# EAGLE design SDRX_40M1 (EAGLE 7.3.0)
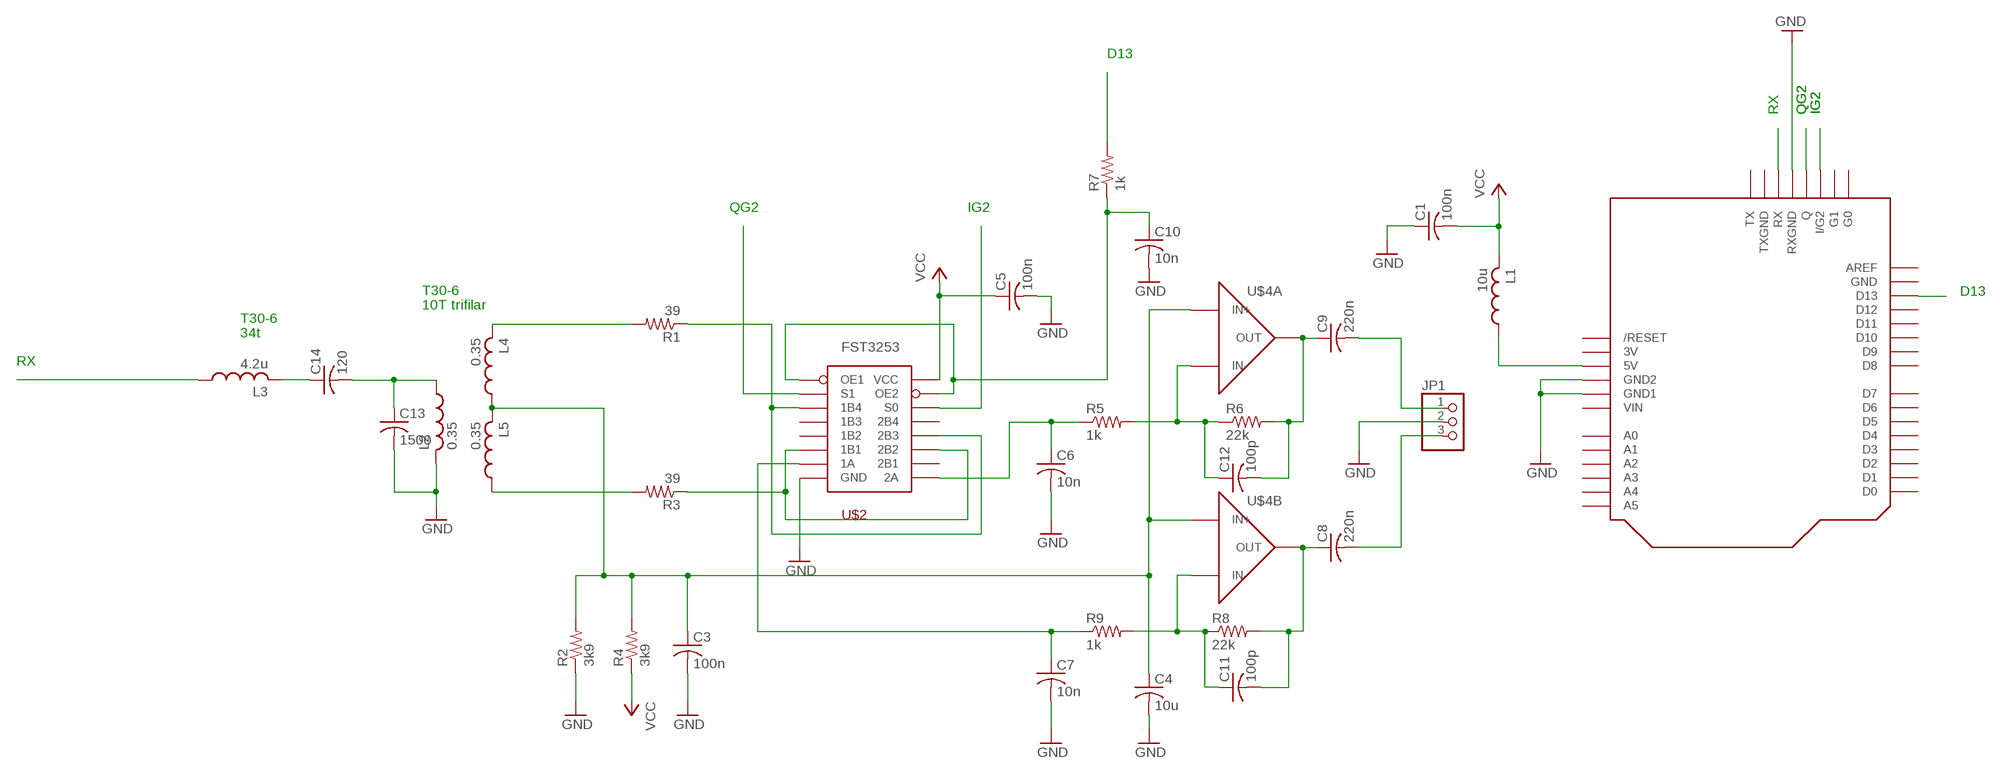
[diagram p0: schematic, sheet 1]

## Parts
C1  100n  C-US050-030X075  [C050-030X075]
C3  100n  C-US050-030X075  [C050-030X075]
C4  10u  C-US050-030X075  [C050-030X075]
C5  100n  C-US050-030X075  [C050-030X075]
C6  10n  C-US050-030X075  [C050-030X075]
C7  10n  C-US050-030X075  [C050-030X075]
C8  220n  C-US050-030X075  [C050-030X075]
C9  220n  C-US050-030X075  [C050-030X075]
C10  10n  C-US050-030X075  [C050-030X075]
C11  100p  C-US050-030X075  [C050-030X075]
C12  100p  C-US050-030X075  [C050-030X075]
C13  1500  C-US050-025X075  [C050-025X075]
C14  120  C-US050-025X075  [C050-025X075]
JP1  PINHD-1X3  [1X03]
L1  10u  L-US0207/10  [0207/10]
L2  0.35  L-US0207/10  [0207/10]
L3  4.2u  L-US0207/10  [0207/10]
L4  0.35  L-US0207/10  [0207/10]
L5  0.35  L-US0207/10  [0207/10]
R1  39  R-US_0207/10  [0207/10]
R2  3k9  R-US_0207/10  [0207/10]
R3  39  R-US_0207/10  [0207/10]
R4  3k9  R-US_0207/10  [0207/10]
R5  1k  R-US_0207/10  [0207/10]
R6  22k  R-US_0207/10  [0207/10]
R7  1k  R-US_0207/10  [0207/10]
R8  22k  R-US_0207/10  [0207/10]
R9  1k  R-US_0207/10  [0207/10]
U$1  RF-SHIELD  [SHIELD-RF]
U$2  FST3253  [FST3253]
U$4  TLV2462  [TLV2462]

## Nets
D13: R7.2 U$1.D13
GND: C1.1 C3.2 C4.2 C5.2 C6.2 C7.2 C10.2 C13.2 JP1.2 L2.2 R2.1 U$1.GND1 U$1.GND2 U$1.RXGND U$2.GND
IG2: U$1.I/G2 U$2.S0
N$1: C3.1 C4.1 L4.1 L5.2 R2.2 R4.2 U$4.3(A:IN+) U$4.5(B:IN+)
N$2: C13.1 C14.2 L2.1
N$3: L4.2 R1.2
N$4: L1.1 U$1.5V
N$5: R3.1 U$2.1B1 U$2.2B2
N$6: L5.1 R3.2
N$7: R1.1 U$2.1B4 U$2.2B3
N$10: C14.1 L3.2
N$12: C10.1 R7.1 U$2.OE1 U$2.OE2
N$14: C9.1 C12.2 R6.2 U$4.1(A:OUT)
N$15: C9.2 JP1.1
N$16: C8.1 C11.2 R8.2 U$4.7(B:OUT)
N$17: C8.2 JP1.3
N$19: C11.1 R8.1 R9.2 U$4.6(B:IN-)
N$21: C12.1 R5.2 R6.1 U$4.2(A:IN-)
N$23: C7.1 R9.1 U$2.1A
N$24: C6.1 R5.1 U$2.2A
QG2: U$1.Q U$2.S1
RX: L3.1 U$1.RX
VCC: C1.2 C5.1 L1.2 R4.1 U$2.VCC
Unconnected: U$1.A0 U$1.A1 U$1.A2 U$1.A3 U$1.A4 U$1.A5 U$1.AREF U$1.D0 U$1.D1 U$1.D2 U$1.D3 U$1.D4 U$1.D5 U$1.D6 U$1.D7 U$1.D8 U$1.D9 U$1.D10 U$1.D11 U$1.D12 U$1.G0 U$1.G1 U$1.RESET(/RESET) U$1.TX U$2.1B2 U$2.1B3 U$2.2B1 U$2.2B4

## Notes on the sheet
- D13
- RX | QG2 | QG2 | IG2 | IG2
- QG2 | IG2
- D13
- T30-6
  10T trifilar
- T30-6
  34t
- RX

## Power pins joined to a net without a drawn wire
3V: U$1.3V
GND: U$1.GND U$4.4(PWR:GND)
TXGND: U$1.TXGND
VCC: U$4.8(PWR:VCC)
VIN: U$1.VIN

## Library data of the parts
C1 C3-C14 = rcl:C-US: CAPACITOR, American symbol
JP1 = pinhead:PINHD-1X3: PIN HEADER
L1-L5 = rcl:L-US: INDUCTOR, American symbol
R1-R9 = rcl:R-US_: RESISTOR, American symbol
U$1 = Arduino-M6KWH:RF-SHIELD: Arduino shield M6KWH RFBUS
U$2 = m6kwh:FST3253: Dual 4 way CMOS Sw
U$4 = m6kwh:TLV2462: Dual Op Amp

## Board
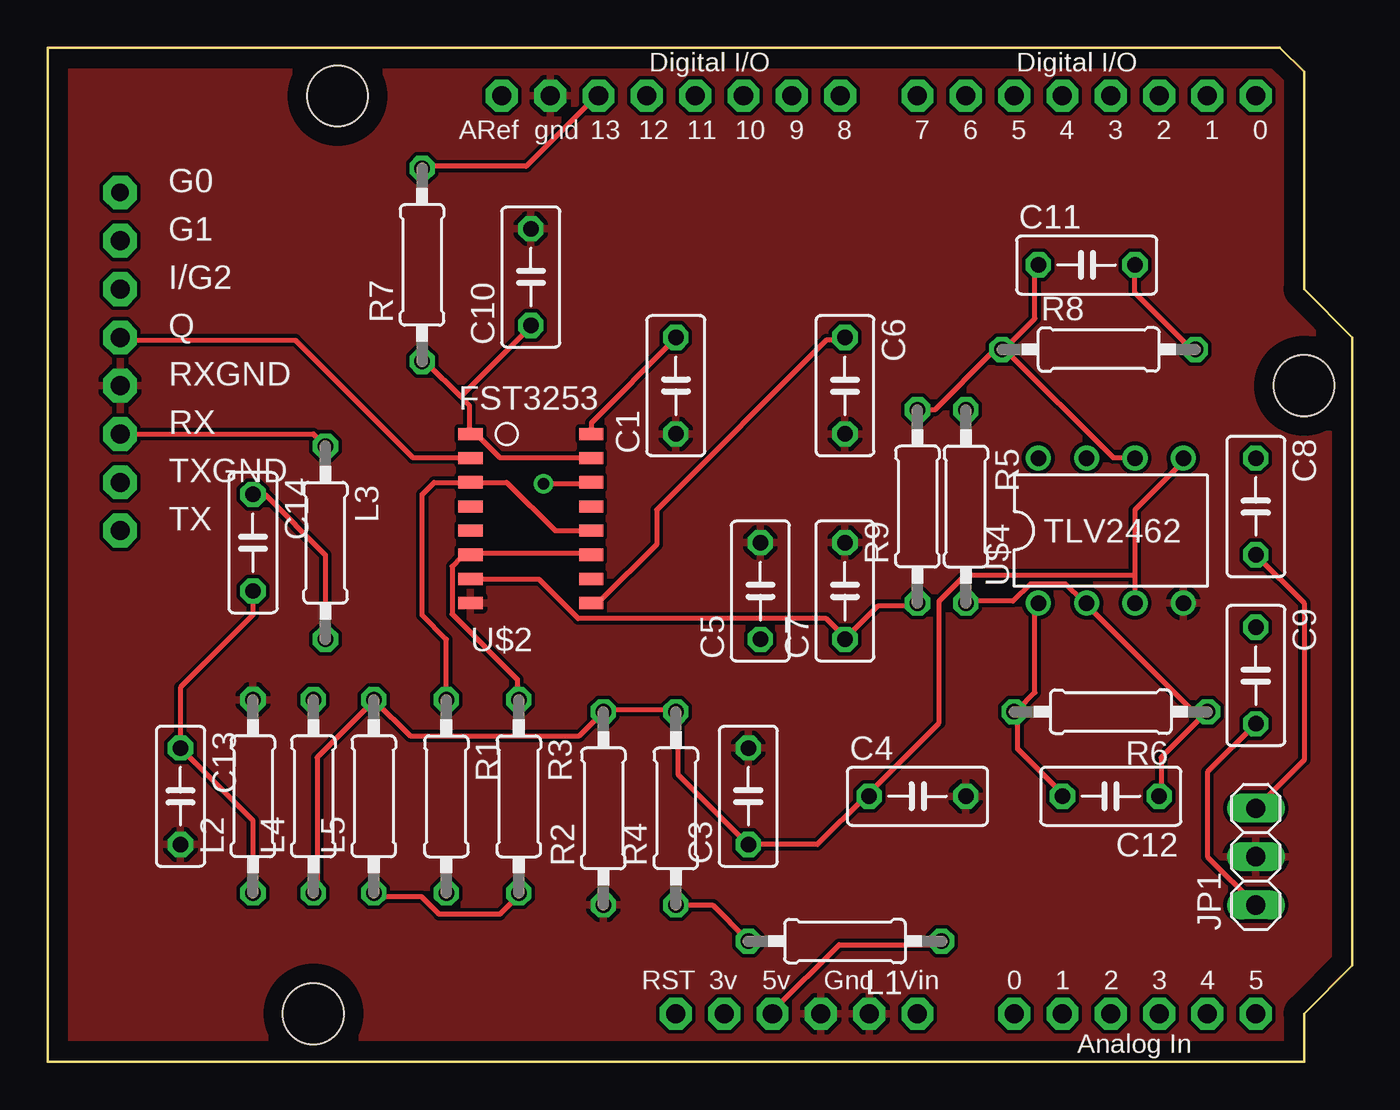
[diagram p1: board, top side]
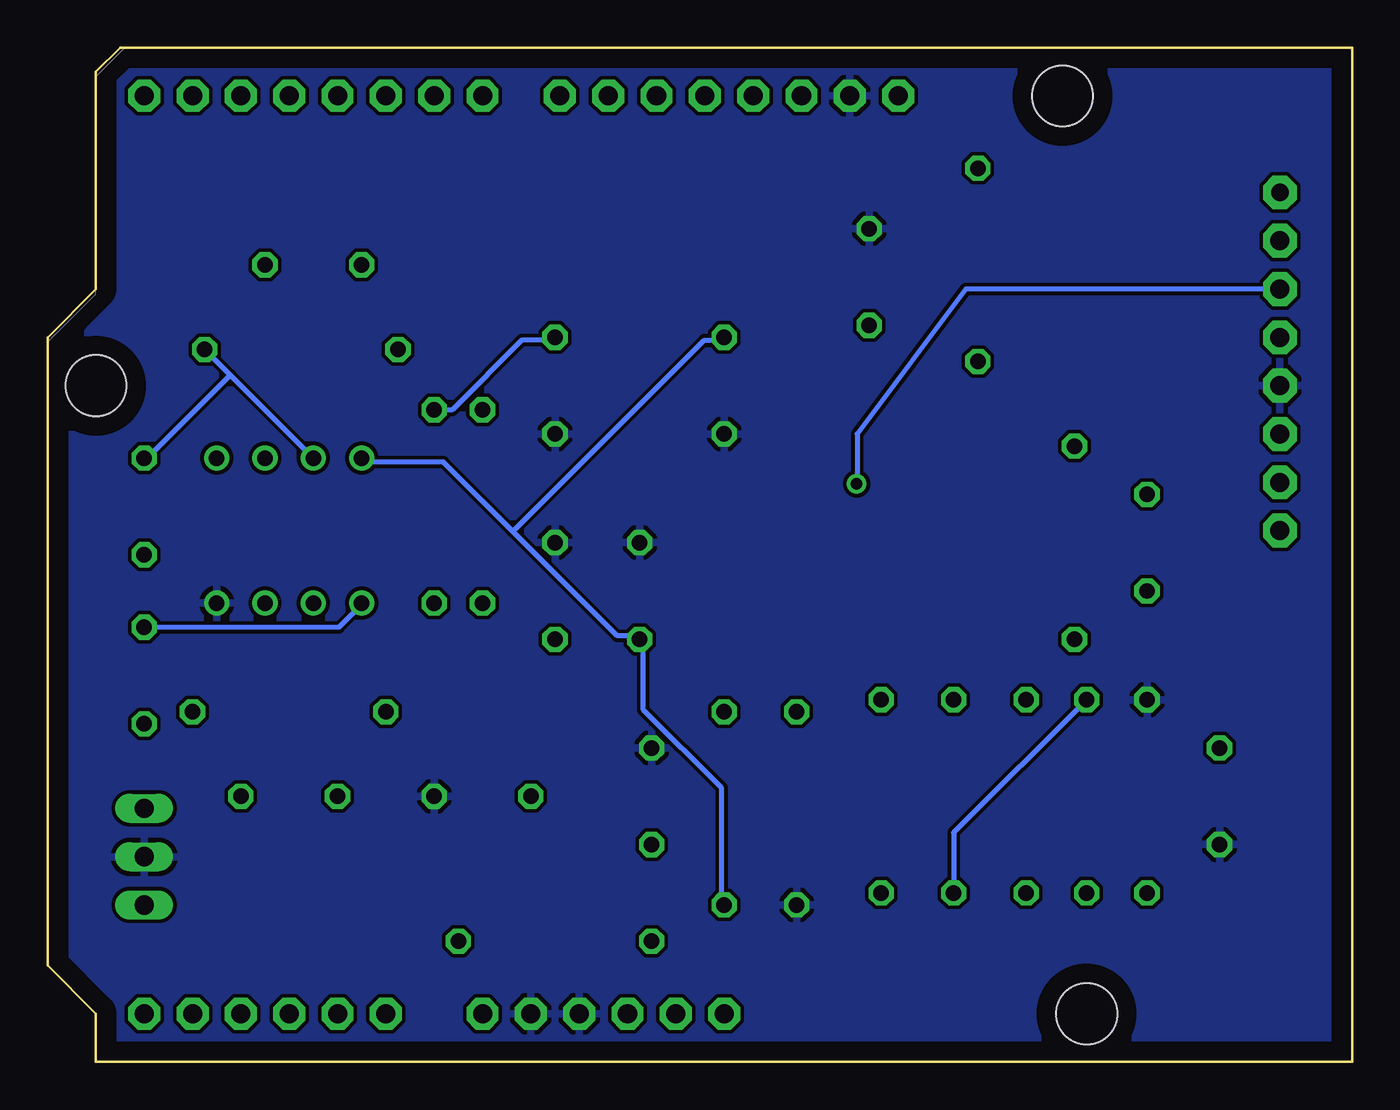
[diagram p2: board, bottom side, seen from below]

Size 68.58 x 53.34 mm. Coordinates in mm from the lower left corner, seen from the top.
Copper layers (1*16): Top 0.035mm / dielectric 1.5mm / Bottom 0.035mm
Design rules "default": minimum track width 10mil, minimum drill 24mil, track to track 8mil, track to pad 8mil, pad to pad 8mil, via to via 8mil, smd to smd 8mil, copper to edge 40mil, drill to drill 8mil, minimum pad ring 10mil, minimum via ring 8mil, stop-mask expansion 4mil, vias tented up to drill 0mil, thermal gap 10mil

### Footprints (pad centres in the part's own frame; a part is rotated, then mirrored left to right if it is on the bottom)
C050-030X075 = drill 0.813 octagon: 1 -2.54,0; 2 2.54,0
C050-025X075 = drill 0.813 octagon: 1 -2.54,0; 2 2.54,0
1X03 = drill 1.016 long: 1 -2.54,0; 2 0,0; 3 2.54,0
0207/10 = drill 0.813 octagon: 1 -5.08,0; 2 5.08,0
SHIELD-RF = drill 1 pad 1.676 octagon: 3V 35.56,2.54; 5V 38.1,2.54; A0 50.8,2.54; A1 53.34,2.54; A2 55.88,2.54; A3 58.42,2.54; A4 60.96,2.54; A5 63.5,2.54; AREF 23.876,50.8; D0 63.5,50.8; D1 60.96,50.8; D2 58.42,50.8; D3 55.88,50.8; D4 53.34,50.8; D5 50.8,50.8; D6 48.26,50.8; D7 45.72,50.8; D8 41.656,50.8; D9 39.116,50.8; D10 36.576,50.8; D11 34.036,50.8; D12 31.496,50.8; D13 28.956,50.8; GND 26.416,50.8; GND1 43.18,2.54; GND2 40.64,2.54; RESET 33.02,2.54; VIN 45.72,2.54 | drill 0.9 pad 1.778 octagon: G0 3.81,45.72 | drill 1 pad 1.778 octagon: G1 3.81,43.18; I/G2 3.81,40.64; Q 3.81,38.1; RX 3.81,33.02; RXGND 3.81,35.56; TX 3.81,27.94; TXGND 3.81,30.48 | hole 3.2: 15.24,50.8; 66.04,35.56; 13.97,2.54
FST3253 = smd 1.27 x 0.635: 1A -3.175,-3.81; 1B1 -3.175,-2.54; 1B2 -3.175,-1.27; 1B3 -3.175,0; 1B4 -3.175,1.27; 2A 3.175,-5.08; 2B1 3.175,-3.81; 2B2 3.175,-2.54; 2B3 3.175,-1.27; 2B4 3.175,0; GND -3.175,-5.08; OE1 -3.175,3.81; OE2 3.175,2.54; S0 3.175,1.27; S1 -3.175,2.54; VCC 3.175,3.81
TLV2462 = drill 0.813 pad 1.27: 1 -3.81,-3.81; 2 -1.27,-3.81; 3 1.27,-3.81; 4 3.81,-3.81; 5 3.81,3.81; 6 1.27,3.81; 7 -1.27,3.81; 8 -3.81,3.81

### Placement (x,y rotation side)
C1  33.02,35.56 90 top
C3  36.83,13.97 90 top
C4  45.72,13.97 0 top
C5  37.47,24.77 90 top
C6  41.91,35.56 270 top
C7  41.91,24.77 90 top
C8  63.5,29.21 270 top
C9  63.5,20.32 270 top
C10  25.4,41.27 90 top
C11  54.61,41.91 0 top
C12  55.88,13.97 180 top
C13  6.99,13.97 270 top
C14  10.79,27.3 270 top
JP1  63.5,10.79 90 top
L1  41.91,6.35 180 top
L2  10.79,13.97 90 top
L3  14.61,27.3 270 top
L4  13.97,13.97 90 top
L5  17.14,13.97 90 top
R1  20.95,13.97 270 top
R2  29.21,13.34 90 top
R3  24.77,13.97 270 top
R4  33.02,13.34 90 top
R5  48.26,29.21 270 top
R6  55.88,18.41 180 top
R7  19.68,41.91 90 top
R8  55.24,37.47 0 top
R9  45.72,29.21 90 top
U$1  0,0 0 top
U$2  25.4,29.21 0 top
U$4  55.88,27.94 0 top

### Tracks (layer width: path | path; a pad name or v marks a point on that pad's centre or on a via)
D13
  Top 0.254: R7.2 19.89,47.09 25.15,47.09 28.8,50.75 U$1.D13
GND
  pour Bottom: 0,53.34 64.77,53.34 66.04,52.07 66.04,40.64 68.58,38.1 68.58,5.08 66.04,2.54 66.04,0 0,0
  pour Top: 0,53.34 64.77,53.34 66.04,52.07 66.04,40.64 68.58,38.1 68.58,5.08 66.04,2.54 66.04,0 0,0
IG2  (via drill 0.61)
  Top 0.254: v26.06,30.4 28.57,30.4 U$2.S0
  Bottom 0.254: U$1.I/G2 20.32,40.64 26.04,33.02 26.04,30.48 v26.06,30.4
N$1
  Top 0.254: L4.1 14.17,8.91 14.17,16 17.14,18.97 L5.2 19.05,17.14 27.94,17.14 R2.2 29.26,18.52 32.92,18.52 R4.2 33.15,18.29 33.15,15.09 36.8,11.43 C3.1 40.46,11.43 42.98,13.95 C4.1 43.2,14.17 46.86,17.83 46.86,24.23 48.23,25.6 57.15,25.6 | 57.15,25.6 57.15,29.03 59.66,31.55 U$4.5 | 57.15,25.6 U$4.3
N$2
  Top 0.254: L2.1 10.79,12.7 C13.1 6.99,19.68 10.79,23.5 C14.2
N$3
  Bottom 0.254: L4.2 20.95,12.06 R1.2
N$4
  Top 0.254: L1.1 46.86,6.17 41.6,6.17 38.18,2.74 U$1.5V
N$5
  Top 0.254: U$2.2B2 28.57,26.75 22.4,26.75 U$2.1B1 22.17,26.52 21.72,26.52 21.26,26.06 21.26,23.55 24.69,20.12 24.69,19.2 R3.1
N$6
  Top 0.254: L5.1 17.14,8.69 19.66,8.69 20.57,7.77 23.77,7.77 24.69,8.69 R3.2
N$7
  Top 0.254: U$2.2B3 26.67,27.94 24.13,30.48 U$2.1B4 20.32,30.48 19.68,29.84 19.68,23.5 20.95,22.23 R1.1
N$10
  Top 0.254: C14.1 11.43,29.84 14.61,26.67 L3.2
N$12
  Top 0.254: 21.72,34.98 19.89,36.8 R7.1 | 21.72,34.98 22.17,34.52 22.17,33.15 U$2.OE1 22.4,33.15 23.77,31.77 28.57,31.77 U$2.OE2 | 21.72,34.98 25.38,38.63 C10.1
N$14
  Top 0.254: C12.2 53.26,14.17 50.98,16.46 50.98,18.29 R6.2 50.98,18.52 51.89,19.43 51.89,24 U$4.1
  Bottom 0.254: C9.1 53.26,22.86 52.12,24 U$4.1
N$15
  Top 0.254: C9.2 60.96,15.24 60.96,10.79 JP1.1
N$16
  Top 0.254: C11.2 57.15,40.46 60.12,37.49 R8.2
  Bottom 0.254: R8.2 58.98,36.12 | 58.98,36.12 U$4.7 | 58.98,36.12 63.32,31.77 C8.1
N$17
  Top 0.254: C8.2 66.04,24.13 66.04,15.88 JP1.3
N$19
  Top 0.254: R9.2 46.63,34.29 49.61,37.26 50.06,37.26 R8.1 50.29,37.49 | 50.29,37.49 56.01,31.77 57.15,31.77 U$4.6 | 50.29,37.49 51.89,39.09 51.89,41.83 C11.1
N$21
  Top 0.254: R5.2 48.46,24.23 50.75,24.23 51.66,25.15 53.49,25.15 54.41,24.23 U$4.2 54.63,24 60.58,18.06 | 60.58,18.06 60.81,18.29 R6.1 60.58,18.06 | 60.58,18.06 58.52,16 58.52,14.17 C12.1
N$23
  Top 0.254: U$2.1A 22.4,25.38 25.83,25.38 27.89,23.32 40.92,23.32 41.83,22.4 C7.1 42.06,22.4 43.66,24 45.72,24 R9.1
N$24
  Top 0.254: U$2.2A 28.57,24.23 29.03,24.23 32,27.2 32,29.03 40.92,37.95 41.83,37.95 C6.1
  Bottom 0.254: R5.1 47.32,34.29 43.66,37.95 42.06,37.95 C6.1
QG2
  Top 0.254: U$2.S1 22.17,31.77 19.2,31.77 13.03,37.95 3.89,37.95 U$1.Q
RX
  Top 0.254: U$1.RX 13.97,33.02 L3.1
VCC
  Top 0.254: U$2.VCC 28.57,33.6 32.92,37.95 C1.2 | R4.1 33.15,8.23 34.98,8.23 36.8,6.4 L1.2
  Bottom 0.254: R4.1 33.15,8.46 33.15,14.4 37.26,18.52 37.26,22.17 C5.1 37.49,22.4 38.63,22.4 44.12,27.89 | 44.12,27.89 47.78,31.55 51.89,31.55 U$4.8 | 44.12,27.89 34.06,37.95 33.15,37.95 C1.2